# EAGLE design nrf_ard (EAGLE 7.2.0)
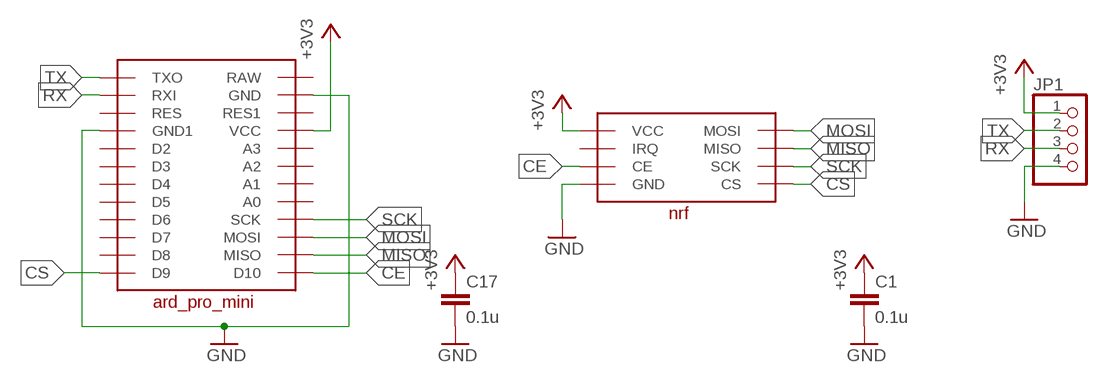
[diagram p0: schematic, sheet 1]

## Parts
C1  0.1u  C-EUC0603K  [C0603K]
C17  0.1u  C-EUC0603K  [C0603K]
JP1  PINHD-1X4  [1X04]
U$1  ARD_PRO_MINI  [ARD_PRO_MINI]
U$2  NRF  [NRF]

## Nets
+3V3: C1.1 C17.1 JP1.1 U$1.VCC U$2.VCC
CE: U$1.D10 U$2.CE
CS: U$1.D9 U$2.CS
GND: C1.2 C17.2 JP1.4 U$1.GND1(GND) U$1.GND2(GND1) U$2.GND
MISO: U$1.MISO U$2.MISO
MOSI: U$1.MOSI U$2.MOSI
RX: JP1.3 U$1.RXI
SCK: U$1.SCK U$2.SCK
TX: JP1.2 U$1.TXO
Unconnected: U$1.A0 U$1.A1 U$1.A2 U$1.A3 U$1.D2 U$1.D3 U$1.D4 U$1.D5 U$1.D6 U$1.D7 U$1.D8 U$1.RAW U$1.RES1(RES) U$1.RST(RES1) U$2.IRQ

## Library data of the parts
C1 C17 = resistor:C-EU: CAPACITOR, European symbol
JP1 = pinhead:PINHD-1X4: PIN HEADER
U$1 = Ard_pro_mini:ARD_PRO_MINI
U$2 = nrf:NRF

## Board
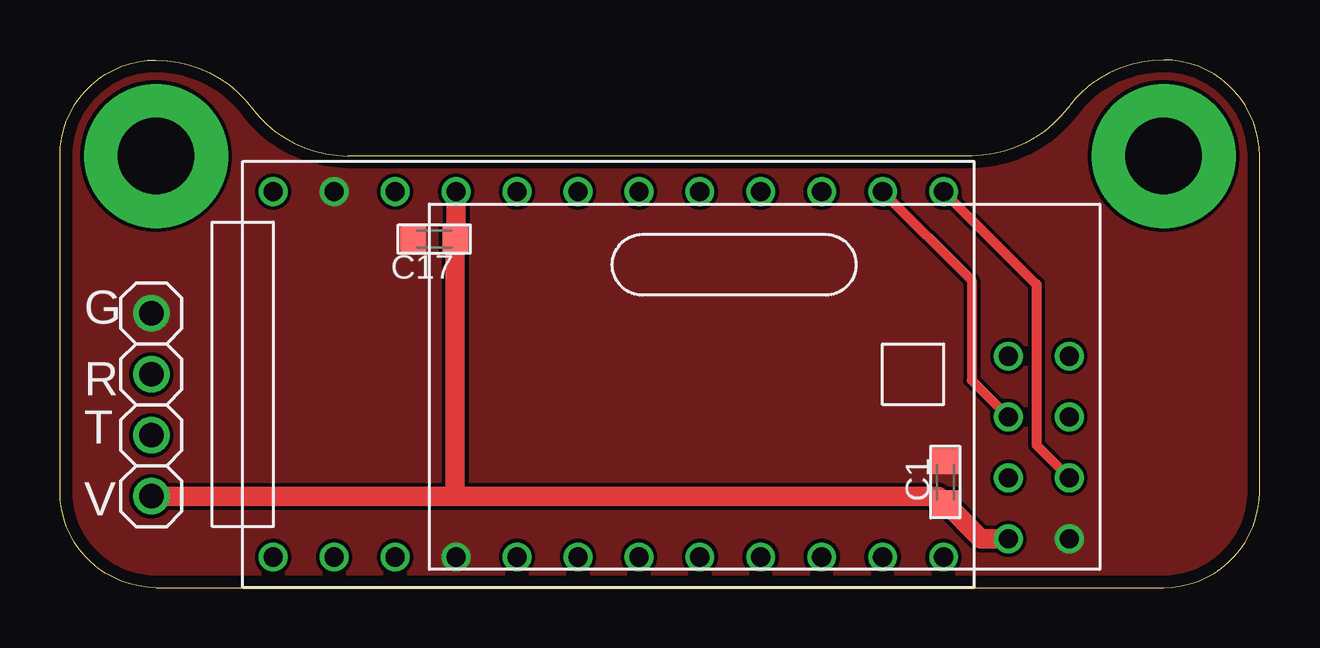
[diagram p1: board, top side]
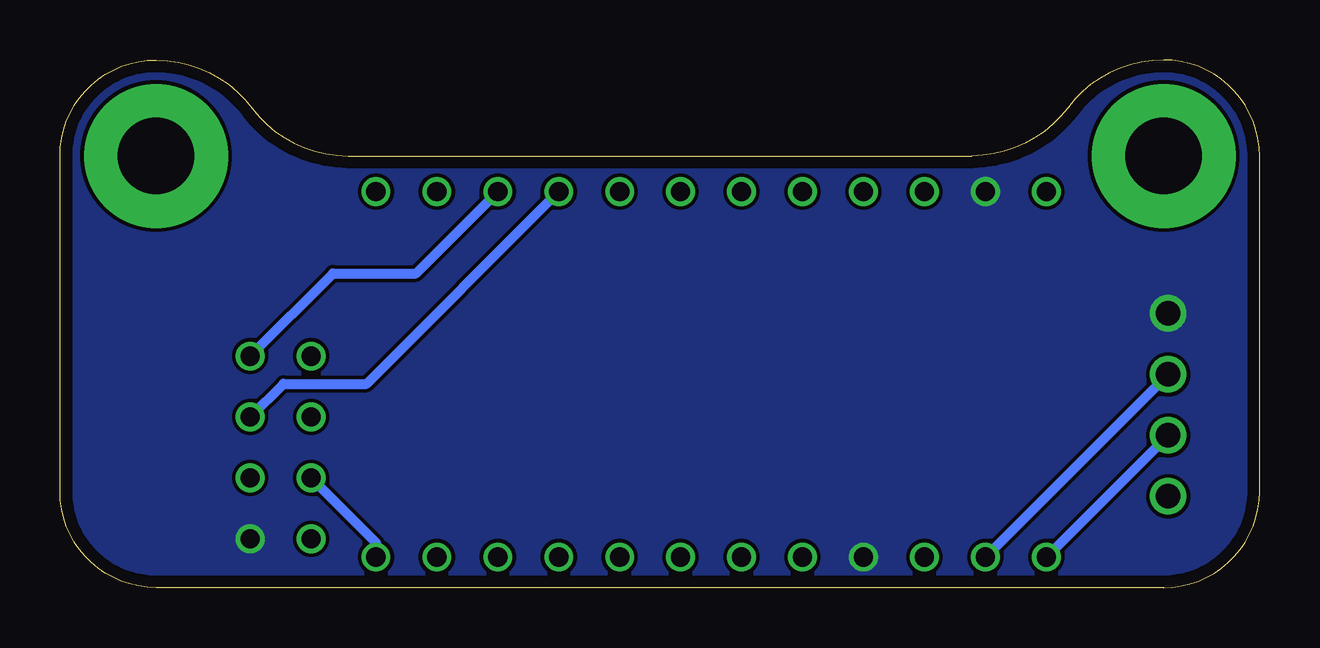
[diagram p2: board, bottom side, seen from below]

Size 50 x 22 mm. Coordinates in mm from the lower left corner, seen from the top.
Outline: 0,18 arc-90 4,22 arc-53 8,20 arc53 12,18 38,18 arc53 42,20 arc-53 46,22 arc-90 50,18 50,4 arc-90 46,0 4,0 arc-90 0,4 0,18
Copper layers (1*16): Top 0.035mm / dielectric 1.6mm / Bottom 0.035mm
Design rules "Elecrow_2-layer_PCB_eagle_rule": minimum track width 6mil, minimum drill 12mil, track to track 6mil, track to pad 6mil, pad to pad 6mil, via to via 8mil, smd to smd 0mil, copper to edge 20mil, drill to drill 10mil, minimum pad ring 6mil, minimum via ring 6mil, stop-mask expansion 0mil, vias tented up to drill 100mil, thermal gap 10mil

### Footprints (pad centres in the part's own frame; a part is rotated, then mirrored left to right if it is on the bottom)
C0603K = smd 1.05 x 1.08: 1 -0.875,0; 2 0.875,0
1X04 = drill 1.016: 1 -3.81,0; 2 -1.27,0; 3 1.27,0; 4 3.81,0
ARD_PRO_MINI = drill 0.8: A0 7.62,0; A1 7.62,2.54; A2 7.62,5.08; A3 7.62,7.62; D2 -7.62,7.62; D3 -7.62,5.08; D4 -7.62,2.54; D5 -7.62,0; D6 -7.62,-2.54; D7 -7.62,-5.08; D8 -7.62,-7.62; D9 -7.62,-10.16; D10 7.62,-10.16; GND1 -7.62,10.16; GND2 7.62,15.24; MISO 7.62,-5.08; MOSI 7.62,-7.62; RAW 7.62,17.78; RES1 7.62,12.7; RST -7.62,12.7; RXI -7.62,15.24; SCK 7.62,-2.54; TXO -7.62,17.78; VCC 7.62,10.16
NRF = drill 0.8: CE 26.67,3.81; CS 24.13,3.81; GND 26.67,1.27; IRQ 24.13,8.89; MISO 26.67,8.89; MOSI 24.13,6.35; SCK 26.67,6.35; VCC 24.13,1.27

### Placement (x,y rotation side)
C1  36.9,4.4 90 top
C17  15.6,14.53 180 top
JP1  3.81,7.62 90 top
U$1  26.67,8.89 90 top
U$2  15.4,0.76 0 top

### Tracks (layer width: path | path; a pad name or v marks a point on that pad's centre or on a via)
+3V3
  Top 0.813: U$1.VCC 16.51,14.56 C17.1 16.48,3.94 16.6,3.81 | JP1.1 16.6,3.81 | 16.6,3.81 36.62,3.81 C1.1 38.4,2.03 U$2.VCC
CE
  Top 0.406: U$1.D10 40.7,12.64 40.7,5.94 U$2.CE
CS
  Bottom 0.406: U$2.CS 36.83,1.87 U$1.D9
GND
  pour Top (rank 6, no thermals): -5.08,26.67 57.15,26.67 57.15,-3.81 -5.08,-3.81
  pour Bottom (rank 6, no thermals): -1.27,24.13 53.34,24.13 53.34,-1.27 -1.27,-1.27
MISO
  Bottom 0.406: U$2.MISO 38.62,13.1 35.16,13.1 U$1.MISO
MOSI
  Top 0.406: U$1.MOSI 38,12.8 38,8.64 U$2.MOSI
N$1  (via drill 3.2 pad 6)
  other vias: 4,18
N$2  (via drill 3.2 pad 6)
  other vias: 46,18
RX
  Bottom 0.406: JP1.3 U$1.RXI
SCK
  Bottom 0.406: U$2.SCK 40.68,8.5 37.22,8.5 U$1.SCK
TX
  Bottom 0.406: JP1.2 U$1.TXO

### Text on the board
tPlace: G | R | T | V